# EAGLE design btConnect (EAGLE 5.09)
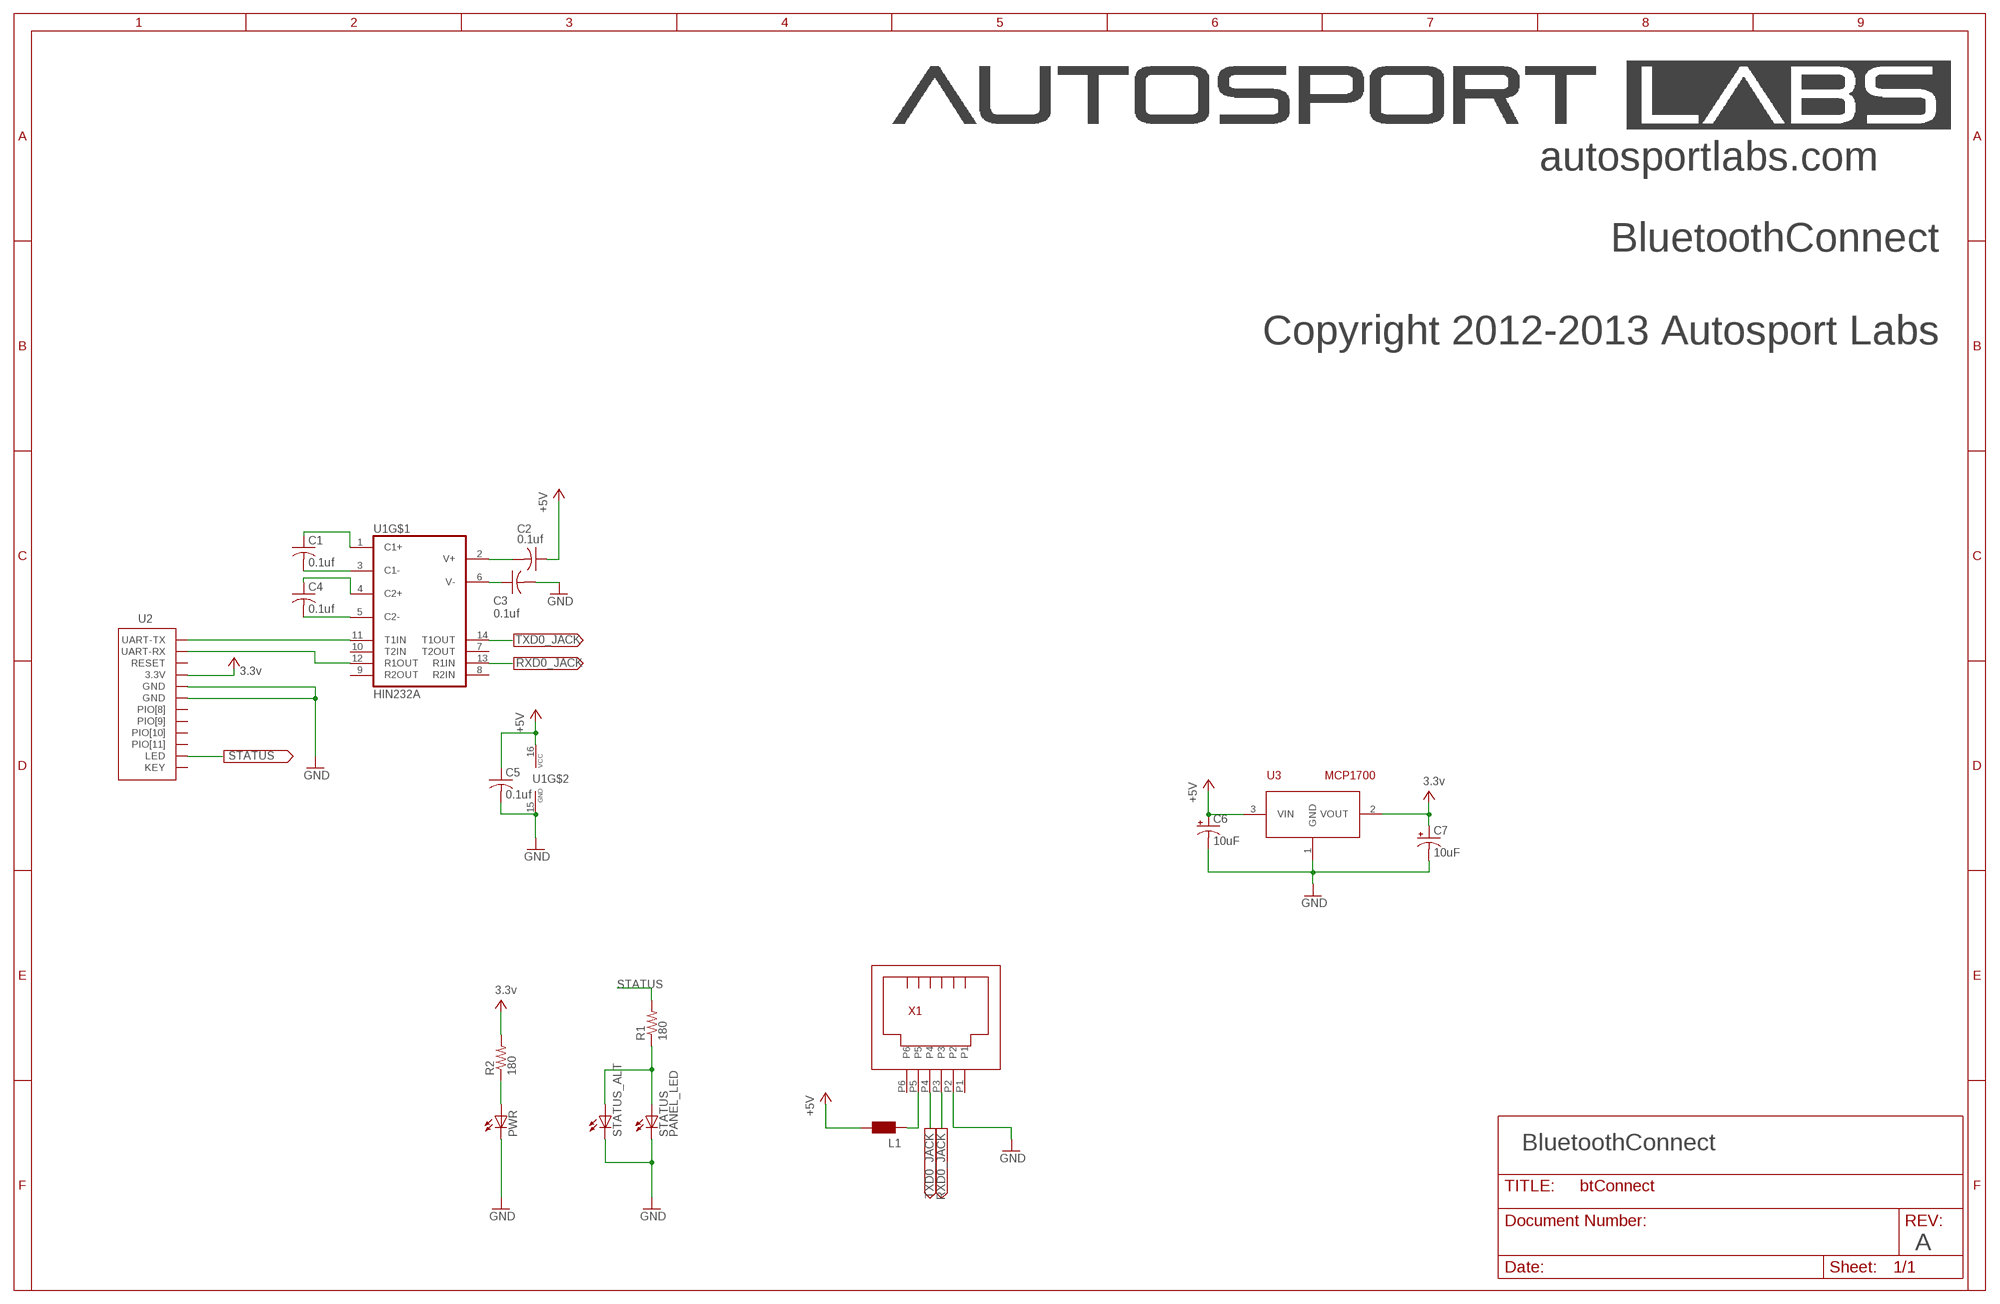
[diagram p0: schematic, sheet 1]

## Parts
C1  0.1uf  C-USC0603  [C0603]
C2  0.1uf  C-USC0603  [C0603]
C3  0.1uf  C-USC0603  [C0603]
C4  0.1uf  C-USC0603  [C0603]
C5  0.1uf  C-USC0603  [C0603]
C6  10uF  CPOL-USSMCA  [SMC_A]
C7  10uF  CPOL-USSMCA  [SMC_A]
L1  WE-CBF_1812  [1812]
PWR  LEDCHIPLED_0603  [CHIPLED_0603]
R1  180  RESISTOR0603  [0603]
R2  180  RESISTOR0603  [0603]
STATUS  PANEL_LED  [RIGHTANGLE_CML_5323F5]
STATUS_ALT  LEDCHIPLED_0603  [CHIPLED_0603]
U1  HIN232A  [SOIC-16]
U2  BLUETOOTH-FRAME  [8P-1.524-27X15-W/-ANT-FRAME]
U3  MCP1700  [SOT-23]
X1  FCI_88400_066LF_RJ12_4POS  [RJ12_RIGHT_ANGLE_PCB]

## Nets
+5V: C2.1 C5.1 C6.+ L1.2 U1.16(VCC) U3.3(VIN)
DIN: U1.12(R1OUT) U2.2(UART-RX)
DOUT: U1.11(T1IN) U2.1(UART-TX)
GND: C3.2 C5.2 C6.- C7.- PWR.C STATUS.C STATUS_ALT.C U1.15(GND) U2.13(GND) U2.22(GND) U3.1(GND) X1.P2
N$1: L1.1 X1.P5
N$2: R1.1 STATUS.A STATUS_ALT.A
N$4: PWR.A R2.1
N$16: C1.1 U1.1(C1+)
N$17: C1.2 U1.3(C1-)
N$18: C4.1 U1.4(C2+)
N$19: C4.2 U1.5(C2-)
N$20: C2.2 U1.2(V+)
N$21: C3.1 U1.6(V-)
RXD0_JACK: U1.13(R1IN) X1.P3
STATUS: R1.2 U2.24(LED)
TXD0_JACK: U1.14(T1OUT) X1.P4
V+: C7.+ R2.2 U2.12(3.3V) U3.2(VOUT) ; supply symbol labelled 3.3v
Unconnected: U1.7(T2OUT) U1.8(R2IN) U1.9(R2OUT) U1.10(T2IN) U2.11(RESET) U2.26(KEY) U2.31(PIO[8]) U2.32(PIO[9]) U2.33(PIO[10]) U2.34(PIO[11]) X1.P1 X1.P6

## Notes on the sheet
- autosportlabs.com
- BluetoothConnect
- Copyright 2012-2013 Autosport Labs
- BluetoothConnect
- A

## Library data of the parts
C1-C5 = rcl:C-US: CAPACITOR, American symbol
C6 C7 = rcl:CPOL-US: POLARIZED CAPACITOR, American symbol
L1 = wuerth-elektronik:WE-CBF: SMD EMI Suppression Ferrite Beads - excellent anti-EMI properties - low DCR - impedances till 3000 ohms - rated current up to 6 A
PWR STATUS_ALT = led:LED: LED OSRAM: - CHIPLED LG R971, LG N971, LY N971, LG Q971, LY Q971, LO R971, LY R971 LH N974, LH R974 LS Q976, LO Q976, LY Q976 LO Q996 - Hyper CHIPLED LW Q18S LB Q993, LB Q99A, LB R99A - SideLED LS A670, LO A670, LY A670, LG A670, LP A670 LB A673, LV A673, LT A673, LW A673 LH A674 LY A675 LS A676, LA A676, LO A676, LY A676, LW A676 LS A679, LY A679, LG A679 - Hyper Micro SIDELED® LS Y876, LA Y876, LO Y876, LY Y876 LT Y87S - SmartLED LW L88C, LW L88S LB L89C, LB L89S, LG L890 LS L89K, LO L89K, LY L89K LS L896, LA L896, LO L896, LY L896 - TOPLED LS T670, LO T670, LY T670, LG T670, LP T670 LSG T670, LSP T670, LSY T670, LOP T670, LYG T670 LG T671, LOG T671, LSG T671 LB T673, LV T673, LT T673, LW T673 LH T674 LS T676, LA T676, LO T676, LY T676, LB T676, LH T676, LSB T676, LW T676 LB T67C, LV T67C, LT T67C, LS T67K, LO T67K, LY T67K, LW E67C LS E67B, LA E67B, LO E67B, LY E67B, LB E67C, LV E67C, LT E67C LW T67C LS T679, LY T679, LG T679 LS T770, LO T770, LY T770, LG T770, LP T770 LB T773, LV T773, LT T773, LW T773 LH T774 LS E675, LA E675, LY E675, LS T675 LS T776, LA T776, LO T776, LY T776, LB T776 LHGB T686 LT T68C, LB T68C - Hyper Mini TOPLED® LB M676 - Mini TOPLED Santana® LG M470 LS M47K, LO M47K, LY M47K Source: http://www.osram.convergy.de LUXEON: - LUMILED® LXK2-PW12-R00, LXK2-PW12-S00, LXK2-PW14-U00, LXK2-PW14-V00 LXK2-PM12-R00, LXK2-PM12-S00, LXK2-PM14-U00 LXK2-PE12-Q00, LXK2-PE12-R00, LXK2-PE12-S00, LXK2-PE14-T00, LXK2-PE14-U00 LXK2-PB12-K00, LXK2-PB12-L00, LXK2-PB12-M00, LXK2-PB14-N00, LXK2-PB14-P00, LXK2-PB14-Q00 LXK2-PR12-L00, LXK2-PR12-M00, LXK2-PR14-Q00, LXK2-PR14-R00 LXK2-PD12-Q00, LXK2-PD12-R00, LXK2-PD12-S00 LXK2-PH12-R00, LXK2-PH12-S00 LXK2-PL12-P00, LXK2-PL12-Q00, LXK2-PL12-R00 Source: www.luxeon.com KINGBRIGHT: KA-3528ASYC Source: www.kingbright.com
R1 R2 = SparkFun:RESISTOR: Resistor Basic schematic elements and footprints for 0603, 1206, and PTH 1/10th watt (small) resistors.
STATUS = LEDs:PANEL_LED
U1 = max232:HIN232A
U2 = Module:BLUETOOTH-FRAME
U3 = mcp1700:MCP1700
X1 = FCI_RJ12:FCI_88400_066LF_RJ12_4POS

## Net classes
1 vcc: width 0.305 mm

## Board
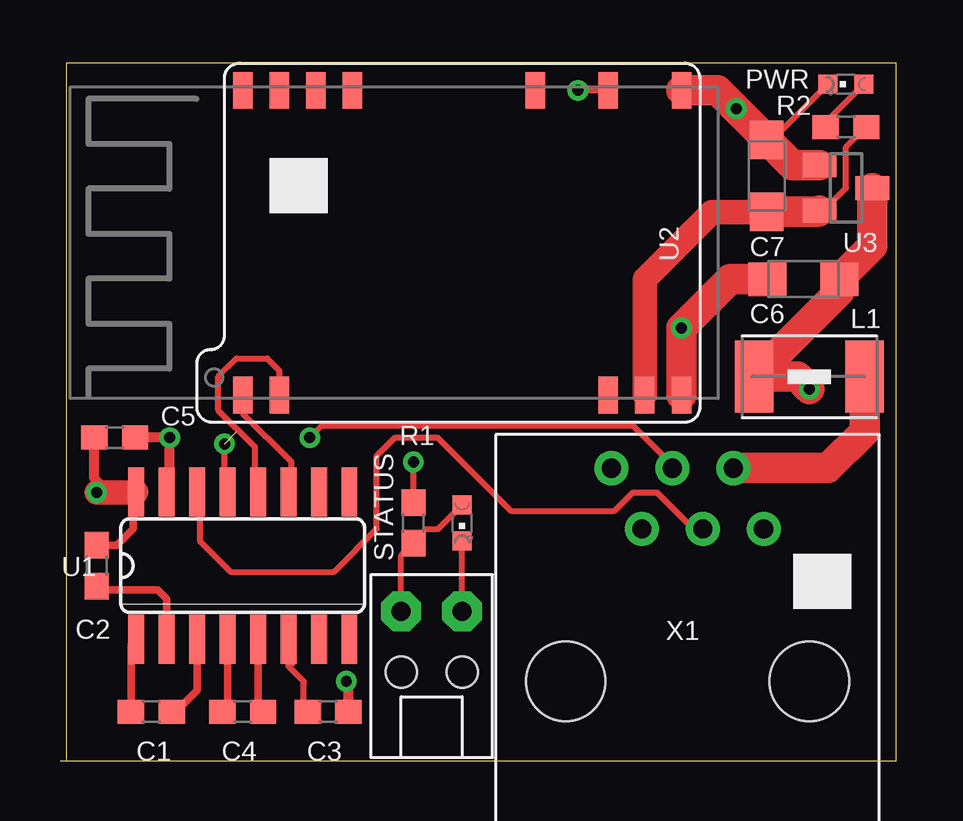
[diagram p1: board, top side]
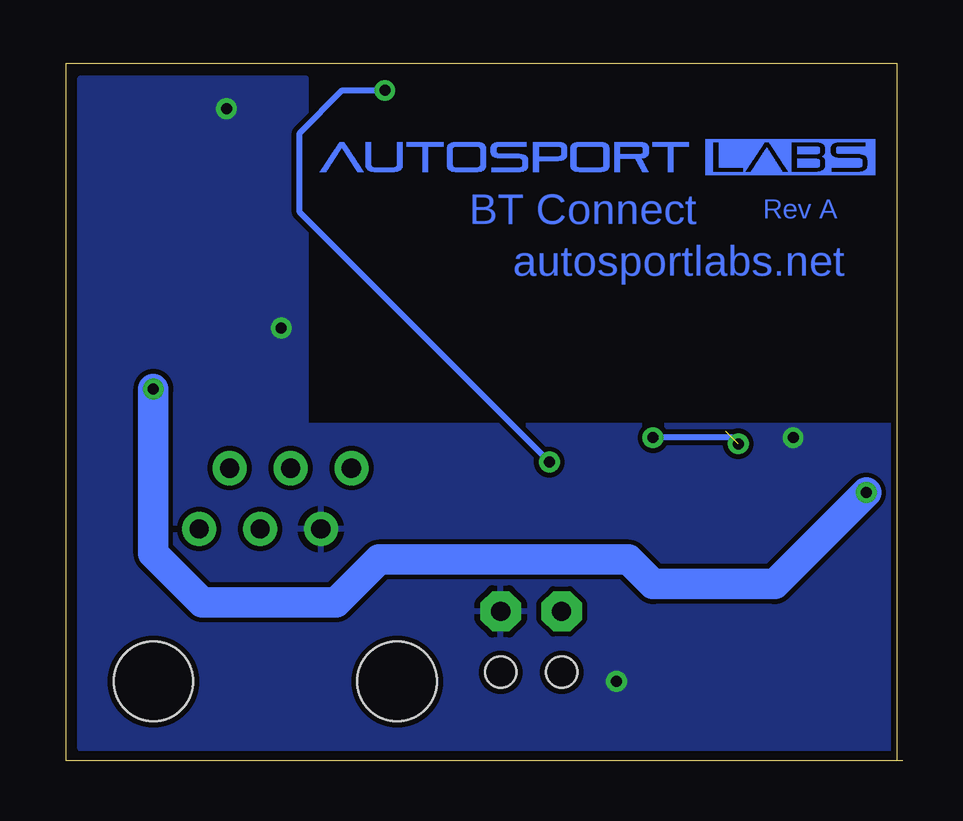
[diagram p2: board, bottom side, seen from below]

Size 34.87 x 29.08 mm. Coordinates in mm from the lower left corner, seen from the top.
Outline: 0.25,0 0.25,29.08 34.87,29.08 34.87,0 0.25,0
Outline: 0,0 0.25,0
Copper layers (1*16): Top 0.035mm / dielectric 1.5mm / Bottom 0.035mm
Design rules "default *": minimum track width 8mil, minimum drill 16mil, track to track 8mil, track to pad 8mil, pad to pad 8mil, via to via 8mil, smd to smd 8mil, copper to edge 10mil, drill to drill 8mil, minimum pad ring 10mil, minimum via ring 8mil, stop-mask expansion 4mil, vias tented up to drill 19mil, thermal gap 10mil

### Footprints (pad centres in the part's own frame; a part is rotated, then mirrored left to right if it is on the bottom)
C0603 = smd 1.1 x 1: 1 -0.85,0; 2 0.85,0
SMC_A = smd 1.6 x 1.4: + -1.5,0; - 1.5,0
1812 = smd 1.6 x 3: 1 -2.3,0; 2 2.3,0
CHIPLED_0603 = smd 0.8 x 0.8: A 0,-0.75; C 0,0.75
0603 = smd 1.1 x 1: 1 -0.85,0; 2 0.85,0
RIGHTANGLE_CML_5323F5 = drill 0.8 pad 1.676 octagon: A -1.27,1.651; C 1.27,1.651 | hole 1.295: 1.27,-0.889; -1.27,-0.889
SOIC-16 = smd 0.66 x 2.032: 1 -4.445,-3.073; 2 -3.175,-3.073; 3 -1.905,-3.073; 4 -0.635,-3.073; 5 0.635,-3.073; 6 1.905,-3.073; 7 3.175,-3.073; 8 4.445,-3.073; 9 4.445,3.073; 10 3.175,3.073; 11 1.905,3.073; 12 0.635,3.073; 13 -0.635,3.073; 14 -1.905,3.073; 15 -3.175,3.073; 16 -4.445,3.073
8P-1.524-27X15-W/-ANT-FRAME = smd 1.524 x 0.813: 1 -6.35,19.05; 2 -6.35,17.526; 11 -6.35,3.81; 12 -6.35,2.286; 13 -6.35,0.762; 22 6.35,0.762; 24 6.35,3.81; 26 6.35,6.858; 31 6.35,14.478; 32 6.35,16.002; 33 6.35,17.526; 34 6.35,19.05
SOT-23 = smd 1 x 1.4: 1 -0.95,-1.1; 2 0.95,-1.1; 3 0,1.1
RJ12_RIGHT_ANGLE_PCB = drill 0.8 pad 1.422 round: P1 -3.175,8.89; P2 -1.905,6.35; P3 -0.635,8.89; P4 0.635,6.35; P5 1.905,8.89; P6 3.175,6.35 | hole 3.302: -5.08,0; 5.08,0

### Placement (x,y rotation side)
C1  3.81,2.03 0 top
C2  1.52,8.13 270 top
C3  11.18,2.03 0 top
C4  7.62,2.03 0 top
C5  2.29,13.46 0 top
C6  30.99,20.07 180 top
C7  29.46,24.38 90 top
L1  31.24,16 180 top
PWR  32.77,28.19 90 top
R1  14.73,9.91 90 top
R2  32.77,26.42 0 top
STATUS  15.49,4.57 0 top
STATUS_ALT  16.76,9.91 180 top
U1  7.62,8.13 0 top
U2  26.67,21.59 90 top
U3  32.77,23.88 270 top
X1  26.16,3.3 0 top

### Tracks (layer width: path | path; a pad name or v marks a point on that pad's centre or on a via)
+5V  (via drill 0.46)
  Top 0.305: C2.1 2.37,8.98 3.05,9.65 3.05,11.07 U1.16
  Top 0.406: C5.1 1.44,11.77 2.03,11.18
  Top 1.016: L1.2 28.94,16.27 | v1.52,11.18 2.03,11.18 3.15,11.18 U1.16
  Top 1.27: U3.3 33.87,21.44 C6.+ 32.49,19.55 L1.2 30.73,16 v31.24,15.49
  Bottom 1.27: v31.24,15.49 31.24,8.64 29.21,6.6 23.62,6.6 21.84,8.38 11.43,8.38 10.41,7.37 5.33,7.37 v1.52,11.18
DIN
  Top 0.254: U2.2 9.14,16.26 8.64,16.76 7.37,16.76 6.6,16 6.6,14.61 8.13,13.08 8.13,11.33 U1.12
  Top 0.305: U1.12 8.38,11.33
DOUT
  Top 0.254: U2.1 7.62,14.48 9.65,12.45 9.65,11.33
  Top 0.305: U1.11 9.65,11.33
GND  (via drill 0.46)
  Top 0.254: STATUS.C STATUS_ALT.C | v28.19,27.18 27.83,27.55 27.8,27.55 | PWR.C 29.71,25.88 C7.-
  Top 0.406: U1.15 4.57,11.33 v4.57,13.46 C5.2 | C3.2 12.03,3.21 v11.94,3.3
  Top 1.27: U2.22 27.41,27.94 27.8,27.55 C7.- 30.52,24.83 U3.1 | U2.13 v25.91,18.03 27.94,20.07 C6.-
  pour Bottom: 0.51,0.51 34.29,0.51 34.29,28.45 24.89,28.45 24.89,13.97 0.51,13.97
N$1
  Top 1.27: X1.P5 32,12.19 33.54,13.73 L1.1
N$2
  Top 0.254: STATUS_ALT.A 15.76,9.65 15.24,9.65 14.73,9.14 R1.1 14.22,8.55 STATUS.A
N$4
  Top 0.254: PWR.A 31.92,26.59 R2.1
N$16
  Top 0.305: C1.1 2.96,4.84 U1.1
N$17
  Top 0.305: C1.2 4.83,2.03 5.71,2.92 U1.3
N$18
  Top 0.305: C4.1 6.98,2.25 U1.4
N$19
  Top 0.305: C4.2 8.25,2.25 U1.5
N$20
  Top 0.305: U1.2 4.45,6.73 4.06,7.11 1.69,7.11 arc-90 C2.2
N$21
  Top 0.254: C3.1 10.16,2.03 10.16,3.3 9.53,3.94 U1.6
  Top 0.305: 9.65,4.06 9.65,4.93 U1.6
RXD0_JACK  (via drill 0.46)  (1 unrouted)
  Top 0.254: v6.86,13.21 6.86,11.33 U1.13 | v10.41,13.46 10.92,13.97 23.88,13.97 25.53,12.32 X1.P3
  Bottom 0.254: v10.41,13.46 7.11,13.46 v6.86,13.21
STATUS  (via drill 0.46)
  Top 0.254: R1.2 v14.73,12.45 | v21.59,27.94 U2.24
  Bottom 0.254: v14.73,12.45 25.15,22.86 25.15,26.16 23.37,27.94 v21.59,27.94
TXD0_JACK
  Top 0.254: U1.14 5.84,11.07 5.84,9.14 7.11,7.87 11.43,7.87 13.21,9.65 13.21,12.7 13.97,13.46 15.75,13.46 18.8,10.41 23.11,10.41 23.88,11.18 24.89,11.18 26.42,9.65 X1.P4
V+
  Top 0.254: R2.2 32.77,25.57 32.77,23.88 31.82,22.93 U3.2
  Top 1.016: U2.12 24.38,20.07 27.18,22.86 29.95,22.86 29.97,22.88
  Top 1.27: U3.2 31.62,22.88 29.97,22.88 C7.+
(copper drawn outside any net)
  shapes: Bottom area x1944

### Text on the board
Bottom: Rev A | BT Connect | autosportlabs.net